# Altium schematic sheet Analog_Front_End.SchDoc
size B; Organization: Mechanart, LLC; Address1: 397 Laurie Meadows Drive; Address2: Apt. 437; Address3: San Mateo, CA 94403
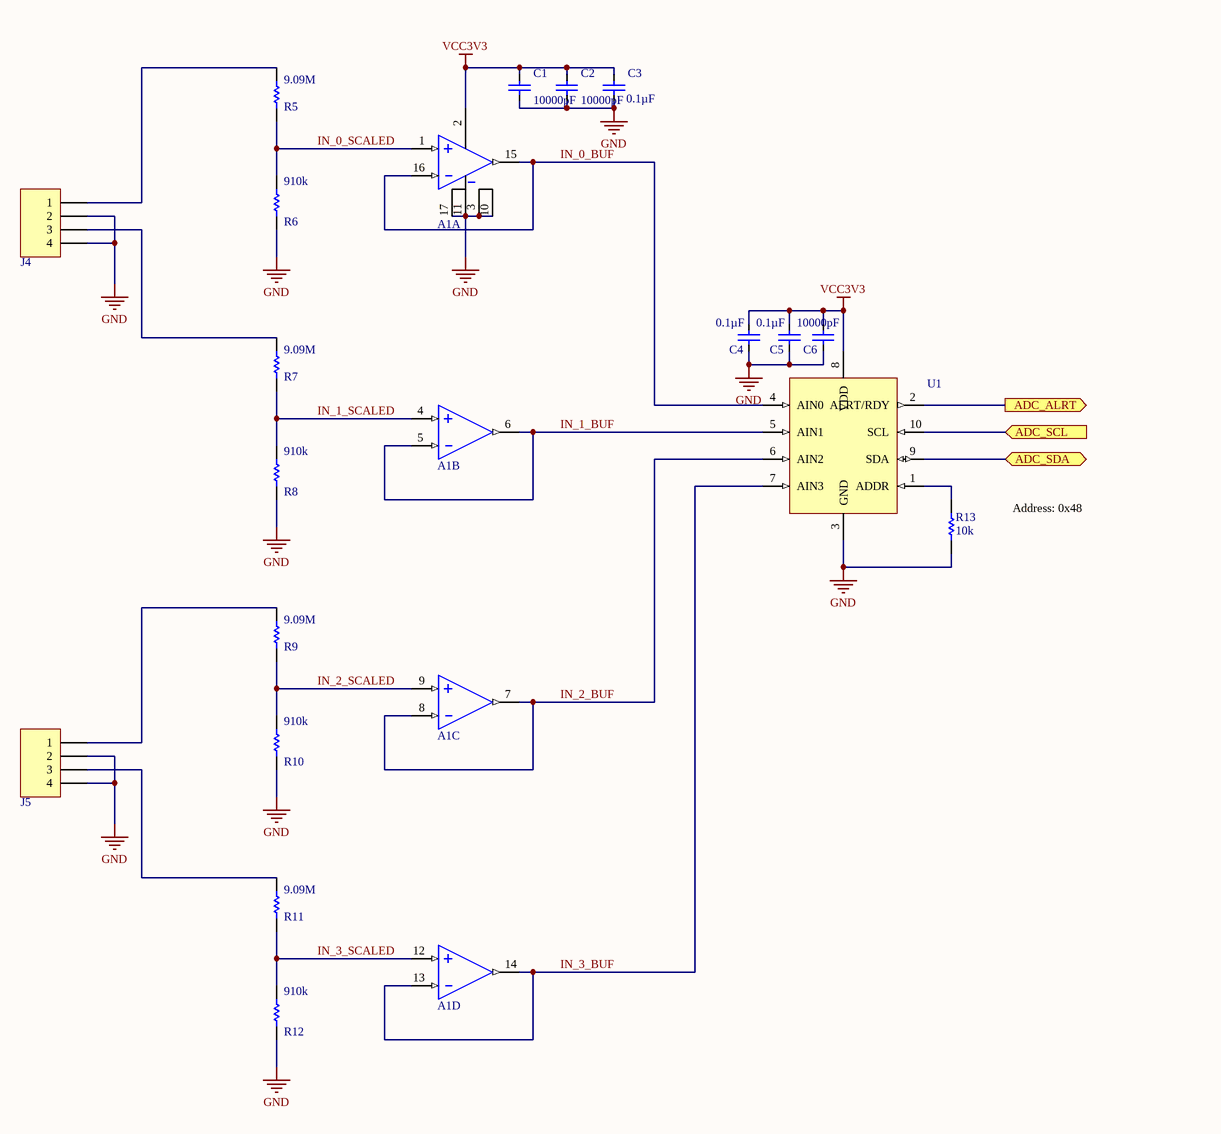
[diagram p0: Analog_Front_End.SchDoc]

## Parts
A1  TSU104  [QFN50P300X300X100-17T180X180L]  (value not drawn)  (parts A,B,C,D of 4)
C1  10000pF  [CAPC1005X50L25N]
C2  10000pF  [CAPC1005X50L25N]
C3  0.1µF  [CAPC1005X50L25N]
C4  0.1µF  [CAPC1005X50L25N]
C5  0.1µF  [CAPC1005X50L25N]
C6  10000pF  [CAPC1005X50L25N]
J4  (no value)  [HEADER_4_RA]
J5  (no value)  [HEADER_4_RA]
R5  9.09M  [RESC1508X50L30L]
R6  910k  [RESC1508X50L30L]
R7  9.09M  [RESC1508X50L30L]
R8  910k  [RESC1508X50L30L]
R9  9.09M  [RESC1508X50L30L]
R10  910k  [RESC1508X50L30L]
R11  9.09M  [RESC1508X50L30L]
R12  910k  [RESC1508X50L30L]
R13  10k  [RESC1005X40L25N]
U1  ADS1115  [X2QFN-10]  (value not drawn)

## Ports
ADC_ALRT (out), ADC_SCL (in), ADC_SDA (bidir)

## Nets
GND: A1.3(NC) A1.10(NC) A1.11(VSS) A1.17(PAD) C1.2 C2.2 C3.2 C4.2 C5.2 C6.2 J4.2 J4.4 J5.2 J5.4 R6.1 R8.1 R10.1 R12.1 R13.1 U1.3(GND)
VCC3V3: A1.2(VDD) C1.1 C2.1 C3.1 C4.1 C5.1 C6.1 U1.8(VDD)
ADC_ALRT: U1.2(ALRT/RDY) ; port ADC_ALRT
ADC_SCL: U1.10(SCL) ; port ADC_SCL
ADC_SDA: U1.9(SDA) ; port ADC_SDA
IN_0_BUF: A1.15(OUTA) A1.16(INA_NEG) U1.4(AIN0)
IN_0_SCALED: A1.1(INA_POS) R5.1 R6.2
IN_1_BUF: A1.5(INB_NEG) A1.6(OUTB) U1.5(AIN1)
IN_1_SCALED: A1.4(INB_POS) R7.1 R8.2
IN_2_BUF: A1.7(OUTC) A1.8(INC_NEG) U1.6(AIN2)
IN_2_SCALED: A1.9(INC_POS) R9.1 R10.2
IN_3_BUF: A1.13(IND_NEG) A1.14(OUTD) U1.7(AIN3)
IN_3_SCALED: A1.12(IND_POS) R11.1 R12.2
NetJ4_1: J4.1 R5.2
NetJ4_3: J4.3 R7.2
NetJ5_1: J5.1 R9.2
NetJ5_3: J5.3 R11.2
NetR13_2: R13.2 U1.1(ADDR)

## Notes on the sheet
- Address: 0x48
- Title
- Size:
- Date:
- B
- Number:
- Time:
- Revision:
- Sheet
- of
- File:

## Library data of the parts
A1 = TSU104IQ4T: IC OPAMP 5V CMOS NANOPWR 16QFN; Manufacturer: STMicroelectronics; Current - Supply: 650nA; Amplifier Type: General Purpose; Number of Circuits: 4; Output Type: Rail-to-Rail; Slew Rate: 0.003 V/µs; Gain Bandwidth Product: 9kHz; Current - Input Bias: 1pA; Voltage - Input Offset: 100µV; Current - Output / Channel: 11mA; Voltage - Supply, Single/Dual (±): 1.5 V ~ 5.5 V; Design Item Id: TSU104IQ4T; Supplier 1: Digi-Key; Supplier Part Number 1: 497-14091-1-ND; Manufacturer Part Number: TSU104IQ4T; RoHS: RoHS Compliant; Category: Integrated Circuits (ICs); Stock 1: 451; Pricing 1: 1=1.65, 10=1.485, 100=1.1914, 500=0.9792, 1000=0.81056 (USD); Packaging: Cut Tape (CT); Operating Temperature: -40°C ~ 85°C; Mounting Type: Surface Mount; Package / Case: 16-VFQFN Exposed Pad; Supplier Device Package: 16-QFN (3x3); ComponentLink1URL: http://www.st.com/st-web-ui/static/active/en/resource/technical/document/datasheet/DM00078536.pdf; ComponentLink1Description: http://www.st.com/st-web-ui/static/active/en/resource/technical/document/datasheet/DM00078536.pdf; -3db Bandwidth: -
C1 C2 C6 = GRM155R71H103KA88D: CAP CER 10000PF 50V X7R 0402; Manufacturer: Murata Electronics North America; Tolerance: ±10%; Design Item Id: GRM155R71H103KA88D; Supplier 1: Digi-Key; Supplier Part Number 1: 490-4516-1-ND; Manufacturer Part Number: GRM155R71H103KA88D; RoHS: RoHS Compliant; Category: Capacitors; Stock 1: 2228905; Pricing 1: 1=0.1, 10=0.012, 50=0.0066, 100=0.0055, 250=0.00452, 500=0.00386, 1000=0.003, 5000=0.0025 (USD); Packaging: Cut Tape (CT); Applications: General Purpose; Operating Temperature: -55°C ~ 125°C; Mounting Type: Surface Mount, MLCC; Package / Case: 0402 (1005 Metric); ComponentLink1URL: http://www.murata.com/~/media/webrenewal/support/library/catalog/products/capacitor/mlcc/c02e.ashx; ComponentLink1Description: http://www.murata.com/~/media/webrenewal/support/library/catalog/products/capacitor/mlcc/c02e.ashx; Capacitance: 10000pF; Voltage - Rated: 50V; Temperature Coefficient: X7R; Ratings: -; Size / Dimension: 0.039" L x 0.020" W (1.00mm x 0.50mm); Height - Seated (Max): -; Thickness (Max): 0.022" (0.55mm); Lead Spacing: -; Features: -; Lead Style: -
C3-C5 = GRM155R71H104KE14D: CAP CER 0.1UF 50V X7R 0402; Manufacturer: Murata Electronics North America; Tolerance: ±10%; Design Item Id: GRM155R71H104KE14D; Supplier 1: Digi-Key; Supplier Part Number 1: 490-10700-1-ND; Manufacturer Part Number: GRM155R71H104KE14D; RoHS: RoHS Compliant; Category: Capacitors; Stock 1: 28600; Pricing 1: 1=0.1, 10=0.029, 50=0.0156, 100=0.0132, 250=0.0108, 500=0.00924, 1000=0.0072, 5000=0.006 (USD); Packaging: Cut Tape (CT); Applications: General Purpose; Operating Temperature: -55°C ~ 125°C; Mounting Type: Surface Mount, MLCC; Package / Case: 0402 (1005 Metric); ComponentLink1URL: http://www.murata.com/~/media/webrenewal/support/library/catalog/products/capacitor/mlcc/c02e.ashx; ComponentLink1Description: http://www.murata.com/~/media/webrenewal/support/library/catalog/products/capacitor/mlcc/c02e.ashx; Capacitance: 0.1µF; Voltage - Rated: 50V; Temperature Coefficient: X7R; Ratings: -; Size / Dimension: 0.039" L x 0.020" W (1.00mm x 0.50mm); Height - Seated (Max): -; Thickness (Max): 0.022" (0.55mm); Lead Spacing: -; Features: -; Lead Style: -
J4 J5 = 5-104186-1: CONN HEADER 4POS R/A GOLD T/H; Manufacturer: TE Connectivity AMP Connectors; Connector Type: Header, Unshrouded; Number of Positions: 4; Number of Positions Loaded: All; Pitch: 0.050" (1.27mm); Design Item Id: 5-104186-1; Supplier 1: Digi-Key; Supplier Part Number 1: A115235-ND; Manufacturer Part Number: 5-104186-1; RoHS: RoHS Compliant; Category: Connectors, Interconnects; Stock 1: 114; Pricing 1: 1=2.67, 25=2.43, 50=2.34, 100=1.96, 500=1.89, 1000=1.61, 2500=1.29, 5000=1.23 (USD); Packaging: Tube; Mounting Type: Through Hole, Right Angle; ComponentLink1URL: http://www.te.com/commerce/DocumentDelivery/DDEController?Action=srchrtrv&DocNm=104186&DocType=Customer+Drawing&DocLang=English; ComponentLink1Description: http://www.te.com/commerce/DocumentDelivery/DDEController?Action=srchrtrv&DocNm=104186&DocType=Customer+Drawing&DocLang=English; Contact Type: Male Pin; Number of Rows: 1; Row Spacing: -; Contact Mating Length: 0.125" (3.18mm); Termination: Solder; Fastening Type: -; Features: -; Contact Finish: Gold; Contact Finish Thickness: 30µin (0.76µm); Color: Black
R5 R7 R9 R11 = CRCW06039M09FKEA: RES SMD 9.09M OHM 1% 1/10W 0603; Manufacturer: Vishay Dale; Power (Watts): 0.1W, 1/10W; Temperature Coefficient: ±100ppm/°C; Design Item Id: CRCW06039M09FKEA; Resistance: 9.09M; Footprint: RESC_1608[0603]_N; Supplier 1: Digi-Key; Supplier Part Number 1: 541-9.09MHCT-ND; Manufacturer Part Number: CRCW06039M09FKEA; RoHS: RoHS Compliant; Category: Resistors; Stock 1: 67332; Pricing 1: 10=0.081, 50=0.0436, 200=0.0251, 1000=0.01711 (USD); Packaging: Cut Tape (CT); Operating Temperature: -55°C ~ 155°C; Package / Case: 0603 (1608 Metric); Supplier Device Package: 0603 (1608 Metric); ComponentLink1URL: http://www.vishay.com/docs/20035/dcrcwe3.pdf; ComponentLink1Description: http://www.vishay.com/docs/20035/dcrcwe3.pdf; Tolerance: ±1%; Composition: Thick Film; Features: Automotive AEC-Q200; Size / Dimension: 0.061" L x 0.033" W (1.55mm x 0.85mm); Height: 0.020" (0.50mm); Number of Terminations: 2
R6 R8 R10 R12 = CRCW0603910KFKEA: RES SMD 910K OHM 1% 1/10W 0603; Manufacturer: Vishay Dale; Power (Watts): 0.1W, 1/10W; Temperature Coefficient: ±100ppm/°C; Design Item Id: CRCW0603910KFKEA; Resistance: 910k; Footprint: RESC_1608[0603]_N; Supplier 1: Digi-Key; Supplier Part Number 1: 541-910KHCT-ND; Manufacturer Part Number: CRCW0603910KFKEA; RoHS: RoHS Compliant; Category: Resistors; Stock 1: 12023; Pricing 1: 10=0.081, 50=0.0436, 200=0.0251, 1000=0.01711 (USD); Packaging: Cut Tape (CT); Operating Temperature: -55°C ~ 155°C; Package / Case: 0603 (1608 Metric); Supplier Device Package: 0603 (1608 Metric); ComponentLink1URL: http://www.vishay.com/docs/20035/dcrcwe3.pdf; ComponentLink1Description: http://www.vishay.com/docs/20035/dcrcwe3.pdf; Tolerance: ±1%; Composition: Thick Film; Features: Automotive AEC-Q200; Size / Dimension: 0.061" L x 0.033" W (1.55mm x 0.85mm); Height: 0.020" (0.50mm); Number of Terminations: 2
R13 = CRCW040210K0JNED: RES SMD 10K OHM 5% 1/16W 0402; Manufacturer: Vishay Dale; Power (Watts): 0.063W, 1/16W; Temperature Coefficient: ±200ppm/°C; Design Item Id: CRCW040210K0JNED; Resistance: 10k; Footprint: RESC_1005[0402]_N; Supplier 1: Digi-Key; Supplier Part Number 1: 541-10KJCT-ND; Manufacturer Part Number: CRCW040210K0JNED; RoHS: RoHS Compliant; Category: Resistors; Stock 1: 446077; Pricing 1: 10=0.074, 50=0.04, 200=0.02295, 1000=0.01566 (USD); Packaging: Cut Tape (CT); Operating Temperature: -55°C ~ 155°C; Package / Case: 0402 (1005 Metric); Supplier Device Package: 0402 (1005 Metric); ComponentLink1URL: http://www.vishay.com/docs/20035/dcrcwe3.pdf; ComponentLink1Description: http://www.vishay.com/docs/20035/dcrcwe3.pdf; Tolerance: ±5%; Composition: Thick Film; Features: Automotive AEC-Q200; Size / Dimension: 0.039" L x 0.020" W (1.00mm x 0.50mm); Height: 0.016" (0.40mm); Number of Terminations: 2
U1 = ADS1115IRUGT: IC ADC 16-BIT I2C PROGBL 10-QFN; Manufacturer: Texas Instruments; INDUSTRY_STD_PKG_TYPE: X2QFN; FAMILY_NAME: PRECISION ADC (<=10MSPS); PIN_COUNT: 10; PACKAGE_DESIGNATOR: RUG; Number of Bits: 16; Sampling Rate (Per Second): 860; Number of Inputs: 2, 4; Input Type: Differential, Single Ended; Data Interface: I²C; Configuration: MUX-PGA-ADC; Number of A/D Converters: 1; Architecture: Sigma-Delta; Reference Type: Internal; Voltage - Supply, Analog: 2 V ~ 5.5 V; Datasheet URL: http://www.ti.com/lit/gpn/ADS1115; GENERIC_PART_NUMBER: ADS1115; RefDes: RefDes; Type: DEV; Value: Value; Design Item Id: ADS1115IRUGT; Supplier 1: Digi-Key; Supplier Part Number 1: 296-24935-1-ND; Manufacturer Part Number: ADS1115IRUGT; RoHS: RoHS Compliant; Category: Integrated Circuits (ICs); Stock 1: 2756; Pricing 1: 1=6.68, 10=5.96, 25=5.36, 50=5.12, 100=4.88 (USD); Packaging: Cut Tape (CT); Operating Temperature: -40°C ~ 125°C; Package / Case: 10-XFQFN; Supplier Device Package: 10-X2QFN (2x1.5); ComponentLink1URL: http://www.ti.com/lit/ds/symlink/ads1113.pdf; ComponentLink1Description: http://www.ti.com/lit/ds/symlink/ads1113.pdf; Voltage - Supply, Digital: 2 V ~ 5.5 V; Features: PGA, Selectable Address